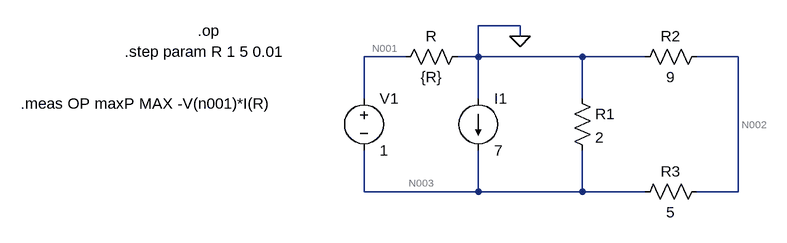
[diagram p0: schematic Q5 att 2.asc]
Q5 att 2.asc, the LTspice schematic file:
Version 4.1
SHEET 1 880 680
WIRE 192 0 128 0
WIRE 192 16 192 0
WIRE 16 48 -48 48
WIRE 128 48 128 0
WIRE 128 48 96 48
WIRE 288 48 128 48
WIRE 384 48 288 48
WIRE 528 48 464 48
WIRE -48 112 -48 48
WIRE 128 112 128 48
WIRE 288 112 288 48
WIRE -48 256 -48 192
WIRE 128 256 128 192
WIRE 128 256 -48 256
WIRE 288 256 288 192
WIRE 288 256 128 256
WIRE 384 256 288 256
WIRE 528 256 528 48
WIRE 528 256 464 256
FLAG 192 16 0
SYMBOL voltage -48 96 R0
WINDOW 123 0 0 Left 0
WINDOW 39 0 0 Left 0
SYMATTR InstName V1
SYMATTR Value 1
SYMBOL current 128 112 R0
WINDOW 123 0 0 Left 0
WINDOW 39 0 0 Left 0
SYMATTR InstName I1
SYMATTR Value 7
SYMBOL res 272 96 R0
SYMATTR InstName R1
SYMATTR Value 2
SYMBOL res 480 32 R90
WINDOW 0 0 56 VBottom 2
WINDOW 3 32 56 VTop 2
SYMATTR InstName R2
SYMATTR Value 9
SYMBOL res 480 240 R90
WINDOW 0 0 56 VBottom 2
WINDOW 3 32 56 VTop 2
SYMATTR InstName R3
SYMATTR Value 5
SYMBOL res 112 32 R90
WINDOW 0 0 56 VBottom 2
WINDOW 3 32 56 VTop 2
SYMATTR InstName R
SYMATTR Value {R}
TEXT -416 40 Left 2 !.step param R 1 5 0.01
TEXT -576 120 Left 2 !.meas OP maxP MAX -V(n001)*I(R)
TEXT -304 8 Left 2 !.op

The netlist it stands for:
* Q5 att 2.asc
V1 N001 N003 1
I1 0 N003 7
R1 0 N003 2
R2 N002 0 9
R3 N002 N003 5
R 0 N001 {R}
.step param R 1 5 0.01
.meas OP maxP MAX -V(n001)*I(R)
.op
.backanno
.end

* Results of the author's LTspice run, read from the files saved beside the schematic
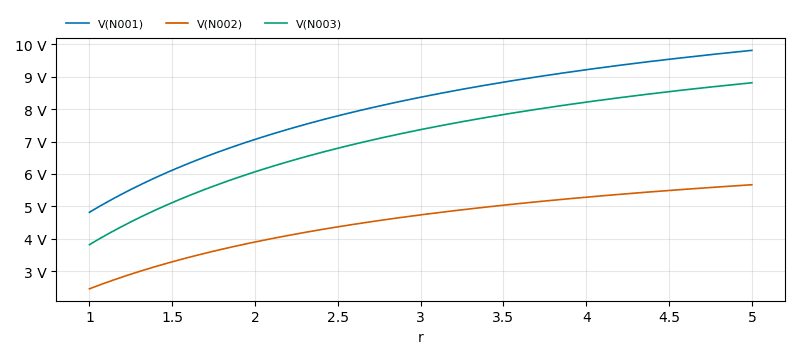
[diagram p1: Operating Point of Q5 att 2.asc, plotted from the saved traces]
* Operating Point, 1 run:
*   V(N001): 4.818 V at r=1 , 9.815 V at r=5 , min 4.818 V, max 9.815 V
*   V(N002): 2.455 V at r=1 , 5.667 V at r=5 , min 2.455 V, max 5.667 V
*   V(N003): 3.818 V at r=1 , 8.815 V at r=5 , min 3.818 V, max 8.815 V
* From the log:
*   maxp: MAX(-V(n001)*I(R))=25.0803578198 FROM 1 TO 5